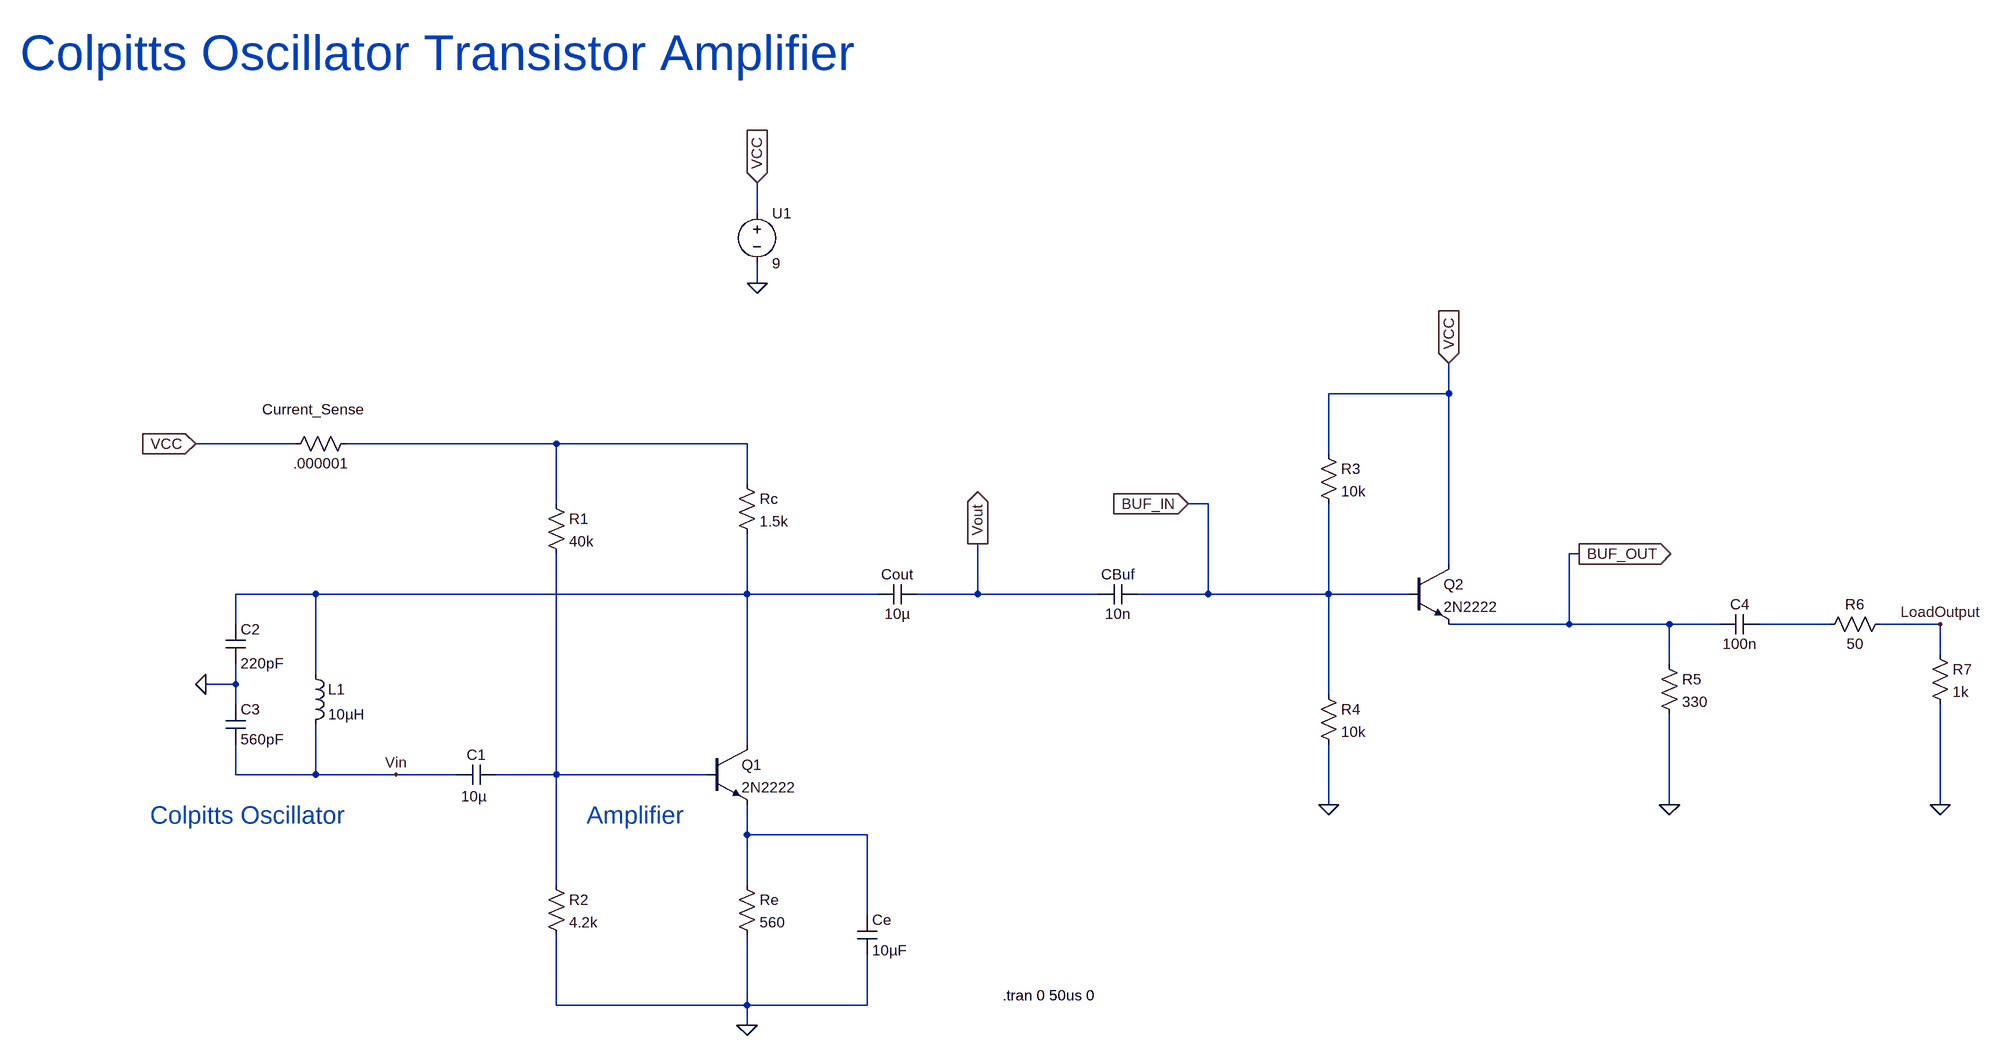
[diagram p0: schematic Colpitts_OscillatorUpdated.asc]
Colpitts_OscillatorUpdated.asc, the LTspice schematic file:
Version 4.1
SHEET 1 3096 680
WIRE 1072 -1488 1072 -1536
WIRE 1072 -1376 1072 -1408
WIRE 2176 -1200 2176 -1248
WIRE 2176 -1200 1984 -1200
WIRE 336 -1120 176 -1120
WIRE 752 -1120 416 -1120
WIRE 1056 -1120 752 -1120
WIRE 1984 -1104 1984 -1200
WIRE 1056 -1056 1056 -1120
WIRE 752 -1024 752 -1120
WIRE 1792 -1024 1760 -1024
WIRE 2384 -944 2368 -944
WIRE 2176 -928 2176 -1200
WIRE 368 -880 240 -880
WIRE 1056 -880 1056 -976
WIRE 1056 -880 368 -880
WIRE 1264 -880 1056 -880
WIRE 1424 -880 1424 -960
WIRE 1424 -880 1328 -880
WIRE 1616 -880 1424 -880
WIRE 1792 -880 1792 -1024
WIRE 1792 -880 1680 -880
WIRE 1984 -880 1984 -1024
WIRE 1984 -880 1792 -880
WIRE 2112 -880 1984 -880
WIRE 240 -832 240 -880
WIRE 2368 -832 2368 -944
WIRE 2368 -832 2176 -832
WIRE 2528 -832 2368 -832
WIRE 2608 -832 2528 -832
WIRE 2784 -832 2672 -832
WIRE 2960 -832 2864 -832
WIRE 2960 -784 2960 -832
WIRE 2528 -768 2528 -832
WIRE 368 -752 368 -880
WIRE 240 -736 240 -768
WIRE 240 -736 192 -736
WIRE 1984 -720 1984 -880
WIRE 240 -704 240 -736
WIRE 1056 -640 1056 -880
WIRE 240 -592 240 -640
WIRE 368 -592 368 -672
WIRE 368 -592 240 -592
WIRE 496 -592 368 -592
WIRE 592 -592 496 -592
WIRE 752 -592 752 -944
WIRE 752 -592 656 -592
WIRE 992 -592 752 -592
WIRE 1984 -544 1984 -640
WIRE 2528 -544 2528 -688
WIRE 2960 -544 2960 -704
WIRE 1056 -496 1056 -544
WIRE 1248 -496 1056 -496
WIRE 752 -416 752 -592
WIRE 1056 -416 1056 -496
WIRE 1248 -368 1248 -496
WIRE 752 -224 752 -336
WIRE 1056 -224 1056 -336
WIRE 1056 -224 752 -224
WIRE 1248 -224 1248 -304
WIRE 1248 -224 1056 -224
WIRE 1056 -192 1056 -224
FLAG 1056 -192 0
FLAG 496 -592 Vin
FLAG 192 -736 0
FLAG 1424 -960 Vout
IOPIN 1424 -960 Out
FLAG 1760 -1024 BUF_IN
IOPIN 1760 -1024 In
FLAG 1072 -1536 VCC
IOPIN 1072 -1536 In
FLAG 1072 -1376 0
FLAG 176 -1120 VCC
IOPIN 176 -1120 In
FLAG 2176 -1248 VCC
IOPIN 2176 -1248 In
FLAG 1984 -544 0
FLAG 2384 -944 BUF_OUT
IOPIN 2384 -944 Out
FLAG 2528 -544 0
FLAG 2960 -544 0
FLAG 2960 -832 LoadOutput
SYMBOL npn 992 -640 R0
SYMATTR InstName Q1
SYMATTR Value 2N2222
SYMBOL voltage 1072 -1504 R0
WINDOW 123 0 0 Left 0
WINDOW 39 0 0 Left 0
SYMATTR InstName U1
SYMATTR Value 9
SYMBOL res 1040 -432 R0
SYMATTR InstName Re
SYMATTR Value 560
SYMBOL res 1040 -1072 R0
SYMATTR InstName Rc
SYMATTR Value 1.5k
SYMBOL res 736 -432 R0
SYMATTR InstName R2
SYMATTR Value 4.2k
SYMBOL res 736 -1040 R0
SYMATTR InstName R1
SYMATTR Value 40k
SYMBOL cap 1328 -896 R90
WINDOW 0 0 32 VBottom 2
WINDOW 3 32 32 VTop 2
SYMATTR InstName Cout
SYMATTR Value 10µ
SYMBOL res 432 -1136 R90
WINDOW 0 -23 68 VBottom 2
WINDOW 3 32 56 VTop 2
SYMATTR InstName Current_Sense
SYMATTR Value .000001
SYMBOL cap 1232 -368 R0
SYMATTR InstName Ce
SYMATTR Value 10µF
SYMBOL cap 656 -608 R90
WINDOW 0 0 32 VBottom 2
WINDOW 3 35 36 VTop 2
SYMATTR InstName C1
SYMATTR Value 10µ
SYMBOL cap 224 -832 R0
WINDOW 3 24 62 Left 2
SYMATTR Value 220pF
SYMATTR InstName C2
SYMBOL cap 224 -704 R0
SYMATTR InstName C3
SYMATTR Value 560pF
SYMBOL ind 352 -768 R0
SYMATTR InstName L1
SYMATTR Value 10µH
SYMBOL npn 2112 -928 R0
SYMATTR InstName Q2
SYMATTR Value 2N2222
SYMBOL cap 1680 -896 R90
WINDOW 0 0 32 VBottom 2
WINDOW 3 32 32 VTop 2
SYMATTR InstName CBuf
SYMATTR Value 10n
SYMBOL res 1968 -1120 R0
SYMATTR InstName R3
SYMATTR Value 10k
SYMBOL res 1968 -736 R0
SYMATTR InstName R4
SYMATTR Value 10k
SYMBOL res 2512 -784 R0
SYMATTR InstName R5
SYMATTR Value 330
SYMBOL res 2880 -848 R90
WINDOW 0 0 56 VBottom 2
WINDOW 3 32 56 VTop 2
SYMATTR InstName R6
SYMATTR Value 50
SYMBOL res 2944 -800 R0
SYMATTR InstName R7
SYMATTR Value 1k
SYMBOL cap 2672 -848 R90
WINDOW 0 0 32 VBottom 2
WINDOW 3 32 32 VTop 2
SYMATTR InstName C4
SYMATTR Value 100n
TEXT 1464 -240 Left 2 !.tran 0 50us 0
TEXT -104 -1744 Left 6 ;Colpitts Oscillator Transistor Amplifier
TEXT 800 -528 Left 4 ;Amplifier
TEXT 104 -528 Left 4 ;Colpitts Oscillator

The netlist it stands for:
* Colpitts_OscillatorUpdated.asc
Q1 N002 N004 N005 0 2N2222
V§U1 VCC 0 9
Re N005 0 560
Rc N001 N002 1.5k
R2 N004 0 4.2k
R1 N001 N004 40k
Cout Vout N002 10µ
R§Current_Sense N001 VCC .000001
Ce N005 0 10µF
C1 N004 Vin 10µ
C2 N002 0 220pF
C3 0 Vin 560pF
L1 N002 Vin 10µH
Q2 VCC BUF_IN BUF_OUT 0 2N2222
CBuf BUF_IN Vout 10n
R3 VCC BUF_IN 10k
R4 BUF_IN 0 10k
R5 BUF_OUT 0 330
R6 LoadOutput N003 50
R7 LoadOutput 0 1k
C4 N003 BUF_OUT 100n
.model NPN NPN
.model PNP PNP
.lib standard.bjt
.tran 0 50us 0
* Colpitts Oscillator Transistor Amplifier
* Amplifier
* Colpitts Oscillator
.backanno
.end